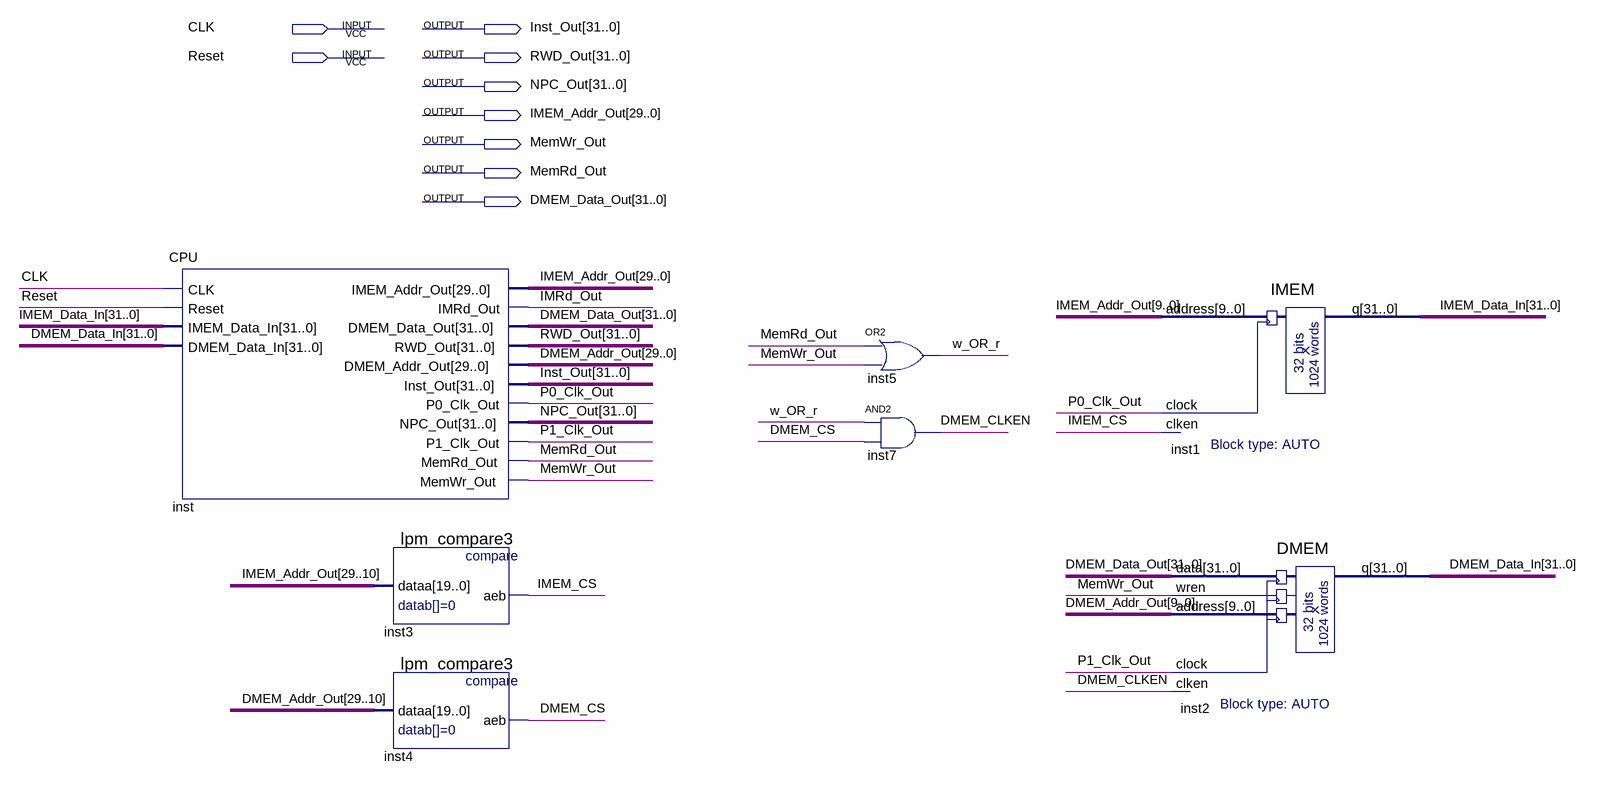
[diagram p0: schematic sheet]
// Quartus schematic Main_Host.bdf as structural Verilog: 7 symbols, 9 pins
module Main_Host (
  input  CLK,
  input  Reset,
  output [31:0] Inst_Out,
  output [31:0] RWD_Out,
  output [31:0] NPC_Out,
  output [29:0] IMEM_Addr_Out,
  output MemWr_Out,
  output MemRd_Out,
  output [31:0] DMEM_Data_Out
);

  wire DMEM_CLKEN, DMEM_CS, IMEM_CS, IMRd_Out, P0_Clk_Out, P1_Clk_Out, w_OR_r;
  wire [29:0] DMEM_Addr_Out;
  wire [31:0] DMEM_Data_In, IMEM_Data_In;

  CPU inst (
    .CLK(CLK), .Reset(Reset), .IMEM_Data_In(IMEM_Data_In), .DMEM_Data_In(DMEM_Data_In),
    .IMEM_Addr_Out(IMEM_Addr_Out), .IMRd_Out(IMRd_Out), .DMEM_Data_Out(DMEM_Data_Out), .RWD_Out(RWD_Out),
    .DMEM_Addr_Out(DMEM_Addr_Out), .Inst_Out(Inst_Out), .P0_Clk_Out(P0_Clk_Out), .NPC_Out(NPC_Out),
    .P1_Clk_Out(P1_Clk_Out), .MemRd_Out(MemRd_Out), .MemWr_Out(MemWr_Out));
  lpm_compare3 inst3 (.dataa(IMEM_Addr_Out[29:10]), .aeb(IMEM_CS));
  lpm_compare3 inst4 (.dataa(DMEM_Addr_Out[29:10]), .aeb(DMEM_CS));
  or inst5 (w_OR_r, MemRd_Out, MemWr_Out);
  and inst7 (DMEM_CLKEN, w_OR_r, DMEM_CS);
  IMEM inst1 (.address(IMEM_Addr_Out[9:0]), .clock(P0_Clk_Out), .clken(IMEM_CS), .q(IMEM_Data_In));
  DMEM inst2 (
    .data(DMEM_Data_Out), .wren(MemWr_Out), .address(DMEM_Addr_Out[9:0]), .clock(P1_Clk_Out),
    .clken(DMEM_CLKEN), .q(DMEM_Data_In));
endmodule
